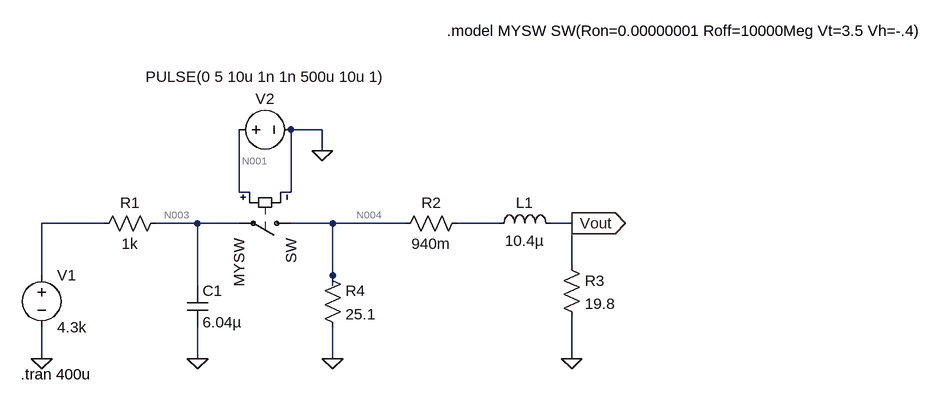
[diagram p0: schematic 45.asc]
45.asc, the LTspice schematic file:
Version 4
SHEET 1 2544 680
WIRE -64 160 -112 160
WIRE -64 192 -64 160
WIRE -192 256 -192 160
WIRE -176 256 -192 256
WIRE -112 256 -112 160
WIRE -112 256 -128 256
WIRE -400 304 -496 304
WIRE -256 304 -320 304
WIRE -192 304 -256 304
WIRE -48 304 -112 304
WIRE 64 304 -48 304
WIRE 208 304 144 304
WIRE 320 304 288 304
WIRE 320 368 320 304
WIRE -496 384 -496 304
WIRE -48 384 -48 304
WIRE -256 400 -256 304
WIRE -48 400 -48 384
WIRE -496 512 -496 464
WIRE -256 512 -256 464
WIRE -48 512 -48 464
WIRE 320 512 320 448
FLAG -496 512 0
FLAG -256 512 0
FLAG -48 512 0
FLAG 320 512 0
FLAG -64 192 0
FLAG 320 304 Vout
IOPIN 320 304 Out
SYMBOL voltage -496 368 R0
SYMATTR InstName V1
SYMATTR Value 4.3k
SYMBOL res -416 320 R270
WINDOW 0 32 56 VTop 2
WINDOW 3 0 56 VBottom 2
SYMATTR InstName R1
SYMATTR Value 1k
SYMBOL cap -272 400 R0
SYMATTR InstName C1
SYMATTR Value 6.04µ
SYMBOL res 160 288 R90
WINDOW 0 0 56 VBottom 2
WINDOW 3 32 56 VTop 2
SYMATTR InstName R2
SYMATTR Value 940m
SYMBOL ind 192 320 R270
WINDOW 0 32 56 VTop 2
WINDOW 3 5 56 VBottom 2
SYMATTR InstName L1
SYMATTR Value 10.4µ
SYMBOL res -64 368 R0
SYMATTR InstName R4
SYMATTR Value 25.1
SYMBOL sw -96 304 R90
SYMATTR InstName SW
SYMATTR Value MYSW
SYMBOL voltage -208 160 R270
WINDOW 0 32 56 VTop 2
WINDOW 3 97 58 VBottom 2
WINDOW 123 0 0 Left 0
WINDOW 39 0 0 Left 0
SYMATTR InstName V2
SYMATTR Value PULSE(0 5 10u 1n 1n 500u 10u 1)
SYMBOL res 304 352 R0
SYMATTR InstName R3
SYMATTR Value 19.8
TEXT 128 8 Left 2 !.model MYSW SW(Ron=0.00000001 Roff=10000Meg Vt=3.5 Vh=-.4)
TEXT -528 536 Left 2 !.tran 400u

The netlist it stands for:
* 45.asc
V1 N002 0 4.3k
R1 N002 N003 1k
C1 N003 0 6.04µ
R2 N005 N004 940m
L1 N005 Vout 10.4µ
R4 N004 0 25.1
SW N004 N003 N001 0 MYSW
V2 N001 0 PULSE(0 5 10u 1n 1n 500u 10u 1)
R3 Vout 0 19.8
.model MYSW SW(Ron=0.00000001 Roff=10000Meg Vt=3.5 Vh=-.4)
.tran 400u
.backanno
.end

* Results of the author's LTspice run, read from the files saved beside the schematic
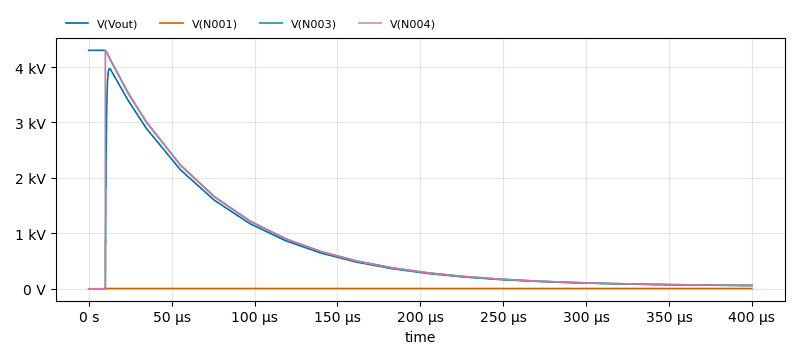
[diagram p1: Transient Analysis of 45.asc, plotted from the saved traces]
* Transient Analysis, 1 run:
*   V(Vout): min 0 V, max 3.967 kV, average 734.9 V, rms 1.218 kV, last 58.86 V
*   V(N001): min 0 V, max 5 V, average 4.875 V, rms 4.937 V, last 5 V
*   V(N003): min 61.56 V, max 4.3 kV, average 877.7 V, rms 1.45 kV, last 61.56 V
*   V(N004): min 0 V, max 4.3 kV, average 770.2 V, rms 1.281 kV, last 61.56 V